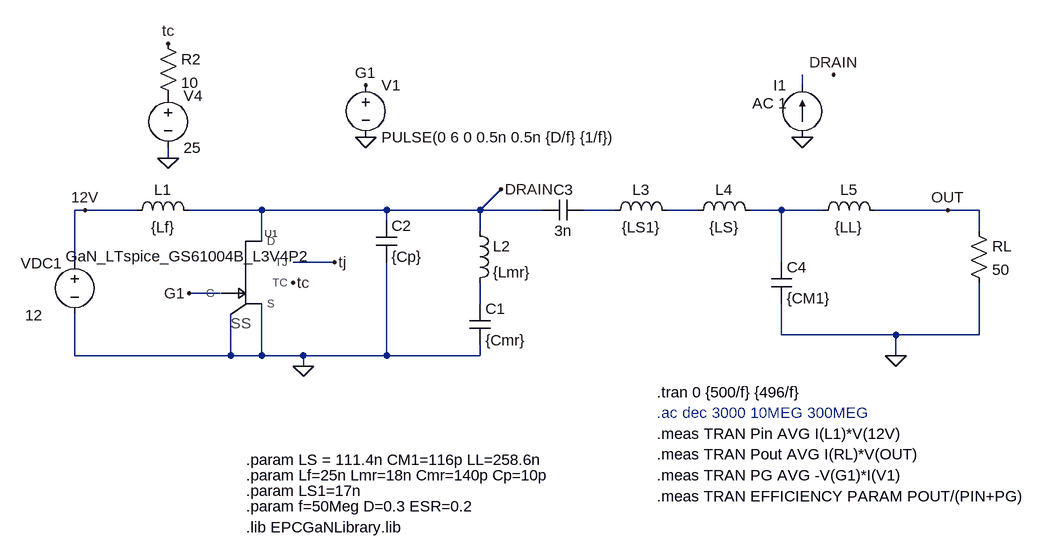
[diagram p0: schematic phi_2_50MHz_GS61004B.asc]
phi_2_50MHz_GS61004B.asc, the LTspice schematic file:
Version 4
SHEET 1 1068 680
WIRE 416 -176 416 -192
WIRE -560 -64 -560 -80
WIRE -688 16 -704 16
WIRE -608 16 -688 16
WIRE -416 16 -528 16
WIRE -224 16 -416 16
WIRE -80 16 -48 -16
WIRE -80 16 -224 16
WIRE 16 16 -80 16
WIRE 128 16 80 16
WIRE 256 16 208 16
WIRE 384 16 336 16
WIRE 448 16 384 16
WIRE 640 16 528 16
WIRE 688 16 640 16
WIRE -224 32 -224 16
WIRE -80 48 -80 16
WIRE 688 48 688 16
WIRE -416 64 -416 16
WIRE -704 96 -704 16
WIRE -304 96 -368 96
WIRE 384 96 384 16
WIRE -480 144 -528 144
WIRE -80 160 -80 128
WIRE 384 208 384 160
WIRE 560 208 384 208
WIRE 688 208 688 128
WIRE 688 208 560 208
WIRE -704 240 -704 176
WIRE -464 240 -464 176
WIRE -464 240 -704 240
WIRE -416 240 -416 160
WIRE -416 240 -464 240
WIRE -352 240 -416 240
WIRE -224 240 -224 96
WIRE -224 240 -352 240
WIRE -80 240 -80 224
WIRE -80 240 -224 240
WIRE 560 240 560 208
WIRE -352 256 -352 240
FLAG -688 16 12V
FLAG -256 -176 G1
FLAG -256 -96 0
FLAG 416 -96 0
FLAG -48 -16 DRAIN
FLAG -352 256 0
FLAG -528 144 G1
FLAG -560 -64 0
FLAG -304 96 tj
FLAG -368 128 tc
FLAG -560 -240 tc
FLAG 464 -192 DRAIN
FLAG 640 16 OUT
FLAG 560 240 0
SYMBOL voltage -704 80 R0
WINDOW 123 0 0 Left 0
WINDOW 39 0 0 Left 0
WINDOW 0 -83 18 Left 2
WINDOW 3 -76 98 Left 2
SYMATTR InstName VDC1
SYMATTR Value 12
SYMBOL cap -96 224 M180
WINDOW 0 24 56 Left 2
WINDOW 3 24 8 Left 2
SYMATTR InstName C1
SYMATTR Value {Cmr}
SYMBOL ind -624 32 R270
WINDOW 0 32 56 VTop 2
WINDOW 3 5 56 VBottom 2
SYMATTR InstName L1
SYMATTR Value {Lf}
SYMATTR SpiceLine Rser={ESR}
SYMBOL ind -96 32 R0
SYMATTR InstName L2
SYMATTR Value {Lmr}
SYMATTR SpiceLine Rser={ESR}
SYMBOL cap -240 32 R0
SYMATTR InstName C2
SYMATTR Value {Cp}
SYMBOL voltage -256 -192 R0
WINDOW 123 0 0 Left 0
WINDOW 39 0 0 Left 0
SYMATTR InstName V1
SYMATTR Value PULSE(0 6 0 0.5n 0.5n {D/f} {1/f})
SYMBOL cap 80 0 R90
WINDOW 0 0 32 VBottom 2
WINDOW 3 32 32 VTop 2
SYMATTR InstName C3
SYMATTR Value 3n
SYMBOL voltage -560 -176 R0
SYMATTR InstName V4
SYMATTR Value 25
SYMBOL res -576 -256 R0
SYMATTR InstName R2
SYMATTR Value 10
SYMBOL current 416 -96 R180
WINDOW 0 24 80 Left 2
WINDOW 3 24 0 Left 2
WINDOW 123 24 52 Left 2
WINDOW 39 0 0 Left 0
SYMATTR InstName I1
SYMATTR Value ""
SYMATTR Value2 AC 1
SYMBOL GaN_LTspice_GS61004B_L3V4P2 -464 112 R0
SYMATTR InstName U1
SYMBOL res 672 32 R0
SYMATTR InstName RL
SYMATTR Value 50
SYMBOL ind 112 32 R270
WINDOW 0 32 56 VTop 2
WINDOW 3 5 56 VBottom 2
SYMATTR InstName L3
SYMATTR Value {LS1}
SYMATTR SpiceLine Rser={ESR}
SYMBOL ind 240 32 R270
WINDOW 0 32 56 VTop 2
WINDOW 3 5 56 VBottom 2
SYMATTR InstName L4
SYMATTR Value {LS}
SYMBOL cap 368 96 R0
SYMATTR InstName C4
SYMATTR Value {CM1}
SYMBOL ind 432 32 R270
WINDOW 0 32 56 VTop 2
WINDOW 3 5 56 VBottom 2
SYMATTR InstName L5
SYMATTR Value {LL}
SYMATTR SpiceLine Rser={ESR}
TEXT -440 472 Left 2 !.param f=50Meg D=0.3 ESR=0.2
TEXT 192 296 Left 2 !.tran 0 {500/f} {496/f}
TEXT -440 504 Left 2 !.lib EPCGaNLibrary.lib
TEXT 192 328 Left 2 ;.ac dec 3000 10MEG 300MEG
TEXT 192 360 Left 2 !.meas TRAN Pin AVG I(L1)*V(12V)
TEXT 192 392 Left 2 !.meas TRAN Pout AVG I(RL)*V(OUT)
TEXT 192 424 Left 2 !.meas TRAN PG AVG -V(G1)*I(V1)
TEXT 192 456 Left 2 !.meas TRAN EFFICIENCY PARAM POUT/(PIN+PG)
TEXT -440 448 Left 2 !.param LS1=17n
TEXT -440 424 Left 2 !.param Lf=25n Lmr=18n Cmr=140p Cp=10p
TEXT -440 400 Left 2 !.param LS = 111.4n CM1=116p LL=258.6n

The netlist it stands for:
* phi_2_50MHz_GS61004B.asc
VDC1 12V 0 12
C1 0 N005 {Cmr}
L1 12V DRAIN {Lf} Rser={ESR}
L2 DRAIN N005 {Lmr} Rser={ESR}
C2 DRAIN 0 {Cp}
V1 G1 0 PULSE(0 6 0 0.5n 0.5n {D/f} {1/f})
C3 N002 DRAIN 3n
V4 P001 0 25
R2 tc P001 10
I1 0 N001 AC 1
XU1 G1 DRAIN 0 0 tc tj GaN_LTspice_GS61004B_L3V4P2  ; pins G D S SS TC TJ
RL OUT 0 50
L3 N002 N003 {LS1} Rser={ESR}
L4 N003 N004 {LS}
C4 N004 0 {CM1}
L5 N004 OUT {LL} Rser={ESR}
.param f=50Meg D=0.3 ESR=0.2
.tran 0 {500/f} {496/f}
.lib EPCGaNLibrary.lib
* .ac dec 3000 10MEG 300MEG
.meas TRAN Pin AVG I(L1)*V(12V)
.meas TRAN Pout AVG I(RL)*V(OUT)
.meas TRAN PG AVG -V(G1)*I(V1)
.meas TRAN EFFICIENCY PARAM POUT/(PIN+PG)
.param LS1=17n
.param Lf=25n Lmr=18n Cmr=140p Cp=10p
.param LS = 111.4n CM1=116p LL=258.6n
.lib GaN_LTspice_GS61004B_L3V4P2.lib
.backanno
.end